# Altium schematic sheet peripherals.SchDoc
size C
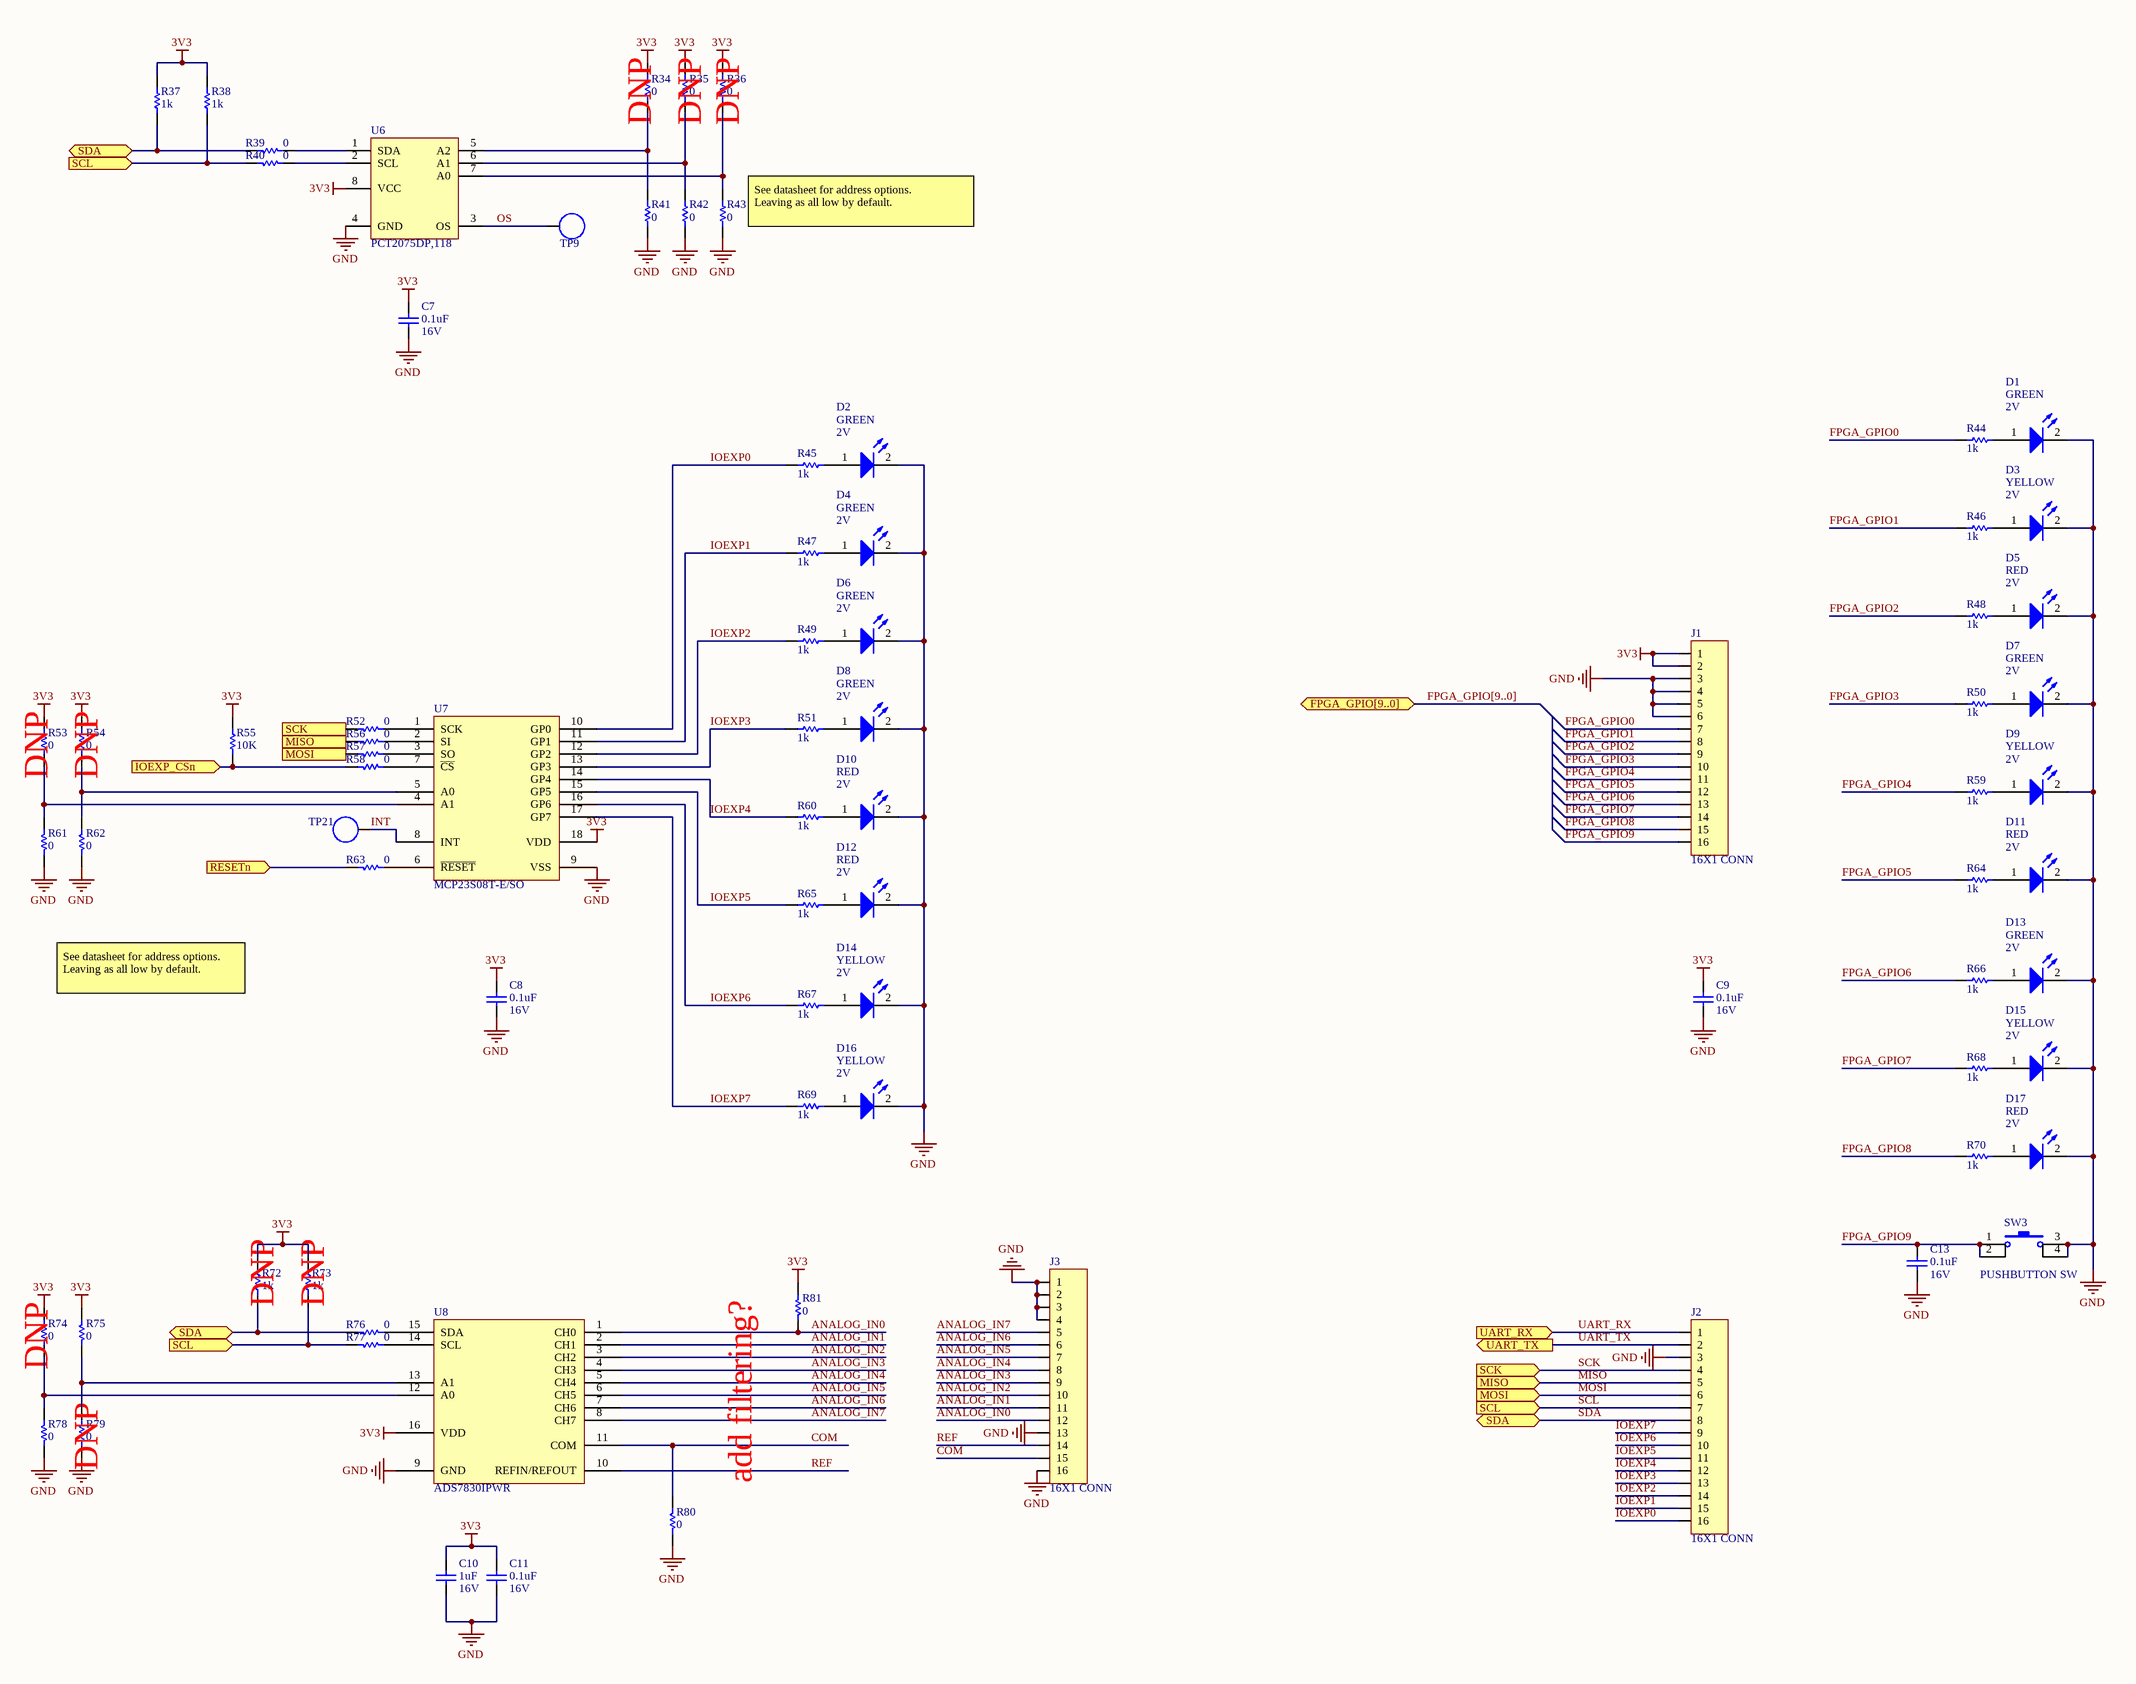
[diagram p0: peripherals.SchDoc]

## Parts
C7  Voltage: 16V  Capacitance: 0.1uF  [0805]  (hidden comment: Cap_NP)
C8  Voltage: 16V  Capacitance: 0.1uF  [0805]  (hidden comment: Cap_NP)
C9  Voltage: 16V  Capacitance: 0.1uF  [0805]  (hidden comment: Cap_NP)
C10  Voltage: 16V  Capacitance: 1uF  [0805]  (hidden comment: Cap_NP)
C11  Voltage: 16V  Capacitance: 0.1uF  [0805]  (hidden comment: Cap_NP)
C13  Voltage: 16V  Capacitance: 0.1uF  [0805]  (hidden comment: Cap_NP)
D1  Vf: 2V  Color: GREEN  [HSMG-C170]  (hidden comment: LED)
D2  Vf: 2V  Color: GREEN  [HSMG-C170]  (hidden comment: LED)
D3  Vf: 2V  Color: YELLOW  [HSMG-C170]  (hidden comment: LED)
D4  Vf: 2V  Color: GREEN  [HSMG-C170]  (hidden comment: LED)
D5  Vf: 2V  Color: RED  [HSMG-C170]  (hidden comment: LED)
D6  Vf: 2V  Color: GREEN  [HSMG-C170]  (hidden comment: LED)
D7  Vf: 2V  Color: GREEN  [HSMG-C170]  (hidden comment: LED)
D8  Vf: 2V  Color: GREEN  [HSMG-C170]  (hidden comment: LED)
D9  Vf: 2V  Color: YELLOW  [HSMG-C170]  (hidden comment: LED)
D10  Vf: 2V  Color: RED  [HSMG-C170]  (hidden comment: LED)
D11  Vf: 2V  Color: RED  [HSMG-C170]  (hidden comment: LED)
D12  Vf: 2V  Color: RED  [HSMG-C170]  (hidden comment: LED)
D13  Vf: 2V  Color: GREEN  [HSMG-C170]  (hidden comment: LED)
D14  Vf: 2V  Color: YELLOW  [HSMG-C170]  (hidden comment: LED)
D15  Vf: 2V  Color: YELLOW  [HSMG-C170]  (hidden comment: LED)
D16  Vf: 2V  Color: YELLOW  [HSMG-C170]  (hidden comment: LED)
D17  Vf: 2V  Color: RED  [HSMG-C170]  (hidden comment: LED)
J1  16X1 CONN  [0.100 16X1 HEADER]
J2  16X1 CONN  [0.100 16X1 HEADER]
J3  16X1 CONN  [0.100 16X1 HEADER]
R34  Resistance: 0  [0805]  (hidden comment: Res)
R35  Resistance: 0  [0805]  (hidden comment: Res)
R36  Resistance: 0  [0805]  (hidden comment: Res)
R37  Resistance: 1k  [0805]  (hidden comment: Res)
R38  Resistance: 1k  [0805]  (hidden comment: Res)
R39  Resistance: 0  [0805]  (hidden comment: Res)
R40  Resistance: 0  [0805]  (hidden comment: Res)
R41  Resistance: 0  [0805]  (hidden comment: Res)
R42  Resistance: 0  [0805]  (hidden comment: Res)
R43  Resistance: 0  [0805]  (hidden comment: Res)
R44  Resistance: 1k  [0805]  (hidden comment: Res)
R45  Resistance: 1k  [0805]  (hidden comment: Res)
R46  Resistance: 1k  [0805]  (hidden comment: Res)
R47  Resistance: 1k  [0805]  (hidden comment: Res)
R48  Resistance: 1k  [0805]  (hidden comment: Res)
R49  Resistance: 1k  [0805]  (hidden comment: Res)
R50  Resistance: 1k  [0805]  (hidden comment: Res)
R51  Resistance: 1k  [0805]  (hidden comment: Res)
R52  Resistance: 0  [0805]  (hidden comment: Res)
R53  Resistance: 0  [0805]  (hidden comment: Res)
R54  Resistance: 0  [0805]  (hidden comment: Res)
R55  Resistance: 10K  [0805]  (hidden comment: Res)
R56  Resistance: 0  [0805]  (hidden comment: Res)
R57  Resistance: 0  [0805]  (hidden comment: Res)
R58  Resistance: 0  [0805]  (hidden comment: Res)
R59  Resistance: 1k  [0805]  (hidden comment: Res)
R60  Resistance: 1k  [0805]  (hidden comment: Res)
R61  Resistance: 0  [0805]  (hidden comment: Res)
R62  Resistance: 0  [0805]  (hidden comment: Res)
R63  Resistance: 0  [0805]  (hidden comment: Res)
R64  Resistance: 1k  [0805]  (hidden comment: Res)
R65  Resistance: 1k  [0805]  (hidden comment: Res)
R66  Resistance: 1k  [0805]  (hidden comment: Res)
R67  Resistance: 1k  [0805]  (hidden comment: Res)
R68  Resistance: 1k  [0805]  (hidden comment: Res)
R69  Resistance: 1k  [0805]  (hidden comment: Res)
R70  Resistance: 1k  [0805]  (hidden comment: Res)
R72  Resistance: 1k  [0805]  (hidden comment: Res)
R73  Resistance: 1k  [0805]  (hidden comment: Res)
R74  Resistance: 0  [0805]  (hidden comment: Res)
R75  Resistance: 0  [0805]  (hidden comment: Res)
R76  Resistance: 0  [0805]  (hidden comment: Res)
R77  Resistance: 0  [0805]  (hidden comment: Res)
R78  Resistance: 0  [0805]  (hidden comment: Res)
R79  Resistance: 0  [0805]  (hidden comment: Res)
R80  Resistance: 0  [0805]  (hidden comment: Res)
R81  Resistance: 0  [0805]  (hidden comment: Res)
SW3  PUSHBUTTON SW  [XKB TS-1187A]
TP9  TP  [KEYSTONE_5012]  (value not drawn)
TP21  TP  [KEYSTONE_5012]  (value not drawn)
U6  PCT2075DP,118  [NXP TSSOP-8 (SOT505-1)]
U7  MCP23S08T-E/SO  [MICROCHIP 18-SOIC]
U8  ADS7830IPWR  [TI PW0016A (16TSSOP)]

## Ports
FPGA_GPIO[9..0] (bidir), IOEXP_CSn (in), MISO (in), MOSI (in), RESETn (in), SCK (in), SCL (in), SDA (bidir), UART_RX (in), UART_TX (out)

## Nets
3V3: C7.2 C8.2 C9.2 C10.2 C11.2 J1.1 J1.2 R34.1 R35.1 R36.1 R37.1 R38.1 R53.1 R54.1 R55.1 R72.1 R73.1 R74.1 R75.1 R81.1 U6.8(VCC) U7.18(VDD) U8.16(VDD)
GND: C7.1 C8.1 C9.1 C10.1 C11.1 C13.1 D1.2(K) D2.2(K) D3.2(K) D4.2(K) D5.2(K) D6.2(K) D7.2(K) D8.2(K) D9.2(K) D10.2(K) D11.2(K) D12.2(K) D13.2(K) D14.2(K) D15.2(K) D16.2(K) D17.2(K) J1.3 J1.4 J1.5 J1.6 J2.3 J3.1 J3.2 J3.3 J3.4 J3.13 J3.16 R41.2 R42.2 R43.2 R61.2 R62.2 R78.2 R79.2 R80.2 SW3.3 SW3.4 U6.4(GND) U7.9(VSS) U8.9(GND)
ANALOG_IN0: J3.12 R81.2 U8.1(CH0)
ANALOG_IN1: J3.11 U8.2(CH1)
ANALOG_IN2: J3.10 U8.3(CH2)
ANALOG_IN3: J3.9 U8.4(CH3)
ANALOG_IN4: J3.8 U8.5(CH4)
ANALOG_IN5: J3.7 U8.6(CH5)
ANALOG_IN6: J3.6 U8.7(CH6)
ANALOG_IN7: J3.5 U8.8(CH7)
COM: J3.15 R80.1 U8.11(COM)
FPGA_GPIO0: J1.7 R44.2
FPGA_GPIO1: J1.8 R46.2
FPGA_GPIO2: J1.9 R48.2
FPGA_GPIO3: J1.10 R50.2
FPGA_GPIO4: J1.11 R59.2
FPGA_GPIO5: J1.12 R64.2
FPGA_GPIO6: J1.13 R66.2
FPGA_GPIO7: J1.14 R68.2
FPGA_GPIO8: J1.15 R70.2
FPGA_GPIO9: C13.2 J1.16 SW3.1 SW3.2
INT: TP21.1 U7.8(INT)
IOEXP0: J2.16 R45.2 U7.10(GP0)
IOEXP1: J2.15 R47.2 U7.11(GP1)
IOEXP2: J2.14 R49.2 U7.12(GP2)
IOEXP3: J2.13 R51.2 U7.13(GP3)
IOEXP4: J2.12 R60.2 U7.14(GP4)
IOEXP5: J2.11 R65.2 U7.15(GP5)
IOEXP6: J2.10 R67.2 U7.16(GP6)
IOEXP7: J2.9 R69.2 U7.17(GP7)
IOEXP_CSn: R55.2 R58.2 ; port IOEXP_CSn
MISO: J2.5 R56.2 ; port MISO
MOSI: J2.6 R57.2 ; port MOSI
OS: TP9.1 U6.3(OS)
REF: J3.14 U8.10(REFIN/REFOUT)
RESETn: R63.2 ; port RESETn
SCK: J2.4 R52.2 ; port SCK
SCL: J2.7 R38.2 R40.2 R73.2 R77.2 ; port SCL
SDA: J2.8 R37.2 R39.2 R72.2 R76.2 ; port SDA
UART_RX: J2.1 ; port UART_RX
UART_TX: J2.2 ; port UART_TX
NetD1_1: D1.1(A) R44.1
NetD2_1: D2.1(A) R45.1
NetD3_1: D3.1(A) R46.1
NetD4_1: D4.1(A) R47.1
NetD5_1: D5.1(A) R48.1
NetD6_1: D6.1(A) R49.1
NetD7_1: D7.1(A) R50.1
NetD8_1: D8.1(A) R51.1
NetD9_1: D9.1(A) R59.1
NetD10_1: D10.1(A) R60.1
NetD11_1: D11.1(A) R64.1
NetD12_1: D12.1(A) R65.1
NetD13_1: D13.1(A) R66.1
NetD14_1: D14.1(A) R67.1
NetD15_1: D15.1(A) R68.1
NetD16_1: D16.1(A) R69.1
NetD17_1: D17.1(A) R70.1
NetR34_2: R34.2 R41.1 U6.5(A2)
NetR35_2: R35.2 R42.1 U6.6(A1)
NetR36_2: R36.2 R43.1 U6.7(A0)
NetR39_1: R39.1 U6.1(SDA)
NetR40_1: R40.1 U6.2(SCL)
NetR52_1: R52.1 U7.1(SCK)
NetR53_2: R53.2 R61.1 U7.4(A1)
NetR54_2: R54.2 R62.1 U7.5(A0)
NetR56_1: R56.1 U7.2(SI)
NetR57_1: R57.1 U7.3(SO)
NetR58_1: R58.1 U7.7(~{CS})
NetR63_1: R63.1 U7.6(~{RESET})
NetR74_2: R74.2 R78.1 U8.12(A0)
NetR75_2: R75.2 R79.1 U8.13(A1)
NetR76_1: R76.1 U8.15(SDA)
NetR77_1: R77.1 U8.14(SCL)

## Buses and harness runs
bus FPGA_GPIO[9..0] = port FPGA_GPIO[9..0]

## Notes on the sheet
- (near R34) DNP
- (near R35) DNP
- (near R36) DNP
- (near R43) See datasheet for address options.
  Leaving as all low by default.
- (near R53) DNP
- (near R54) DNP
- See datasheet for address options.
  Leaving as all low by default.
- (near R72) DNP
- (near R73) DNP
- (near R74) DNP
- (near R79) DNP
- add filtering?
- PCBA Name
- PCBA REV
- PCB Engineer
- Sheet Name
- 140 Center St., El Segundo, CA 90245
- SECOND ORDER EFFECTS
- www.soeffects.com
- PCBA Part Number
- Review Ticket ID
- Project
- Sheet Number
- /

## Library data of the parts
C7-C9 C11 C13 = Cap_NP: Capacitor; Manufacturer PN: C0805C104M4VACTU; Manufacturer: KEMET; Tolerance: *
C10 = Cap_NP: Capacitor; Manufacturer PN: EMK212BJ105MD-T; Manufacturer: Taiyo Yuden; Tolerance: *
D1-D17 = LED: Manufacturer: Broadcom; Manufacturer PN: HSMG-C170
J1-J3 = 16X1 CONN: Manufacturer PN: PPTC161LFBN-RC; Manufacturer: Sullins
R34-R36 R39-R43 R52-R54 R56-R58 R61-R63 R74-R81 = Res: Resistor; Manufacturer PN: RMCF0805ZT0R00; Manufacturer: Stackpole Electronics Inc; Tolerance: Jumper; Power Rating: 1/10W
R37 R38 R44-R51 R59 R60 R64-R70 R72 R73 = Res: Resistor; Manufacturer PN: RMCF0805JT1K00; Manufacturer: Stackpole Electronics Inc; Tolerance: 5%; Power Rating: 1/8W
R55 = Res: Resistor; Manufacturer PN: RMCF0805JT10K0; Manufacturer: Stackpole Electronics Inc; Tolerance: 5%; Power Rating: 1/8W
SW3 = SWITCH_PB: Manufacturer PN: TS-1187A-C-E-B; Manufacturer: XKB
TP9 TP21 = TP: Manufacturer PN: 5015; Manufacturer: Keystone
U6 = PCT2075DP,118: Temperature Sensor Digital, Local -55°C ~ 125°C 11 b 8-TSSOP; Manufacturer: NXP; Manufacturer PN: PCT2075DP,118
U7 = MCP23S08T-E/SO: Manufacturer: Microchip; Manufacturer PN: MCP23S08T-E/SO
U8 = ADS7830IPWR: Manufacturer: Texas Instruments; Manufacturer PN: ADS7830IPWR